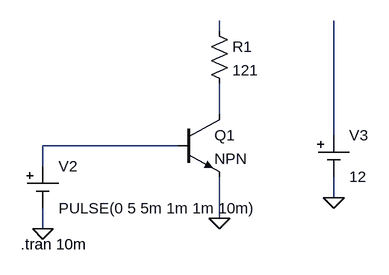
[diagram p0: schematic simulation1_only_R.asc]
simulation1_only_R.asc, the LTspice schematic file:
Version 4
SHEET 1 880 680
WIRE 192 -48 192 -64
WIRE 192 80 192 32
WIRE 368 112 368 -64
WIRE 128 128 -80 128
WIRE -80 160 -80 128
WIRE 368 208 368 176
WIRE 192 240 192 176
WIRE -80 256 -80 224
FLAG 192 240 0
FLAG -80 256 0
FLAG 368 208 0
SYMBOL npn 128 80 R0
SYMATTR InstName Q1
SYMBOL res 176 -64 R0
SYMATTR InstName R1
SYMATTR Value 121
SYMATTR SpiceLine tol=1 pwr=0.1
SYMBOL Misc\\cell -80 160 R0
WINDOW 123 0 0 Left 0
WINDOW 39 0 0 Left 0
SYMATTR InstName V2
SYMATTR Value PULSE(0 5 5m 1m 1m 10m)
SYMBOL Misc\\cell 368 112 R0
WINDOW 123 0 0 Left 0
WINDOW 39 0 0 Left 0
SYMATTR InstName V3
SYMATTR Value 12
TEXT -114 280 Left 2 !.tran 10m

The netlist it stands for:
* simulation1_only_R.asc
Q1 N002 N004 0 0 NPN
R1 N001 N002 121 tol=1 pwr=0.1
V2 N004 0 PULSE(0 5 5m 1m 1m 10m)
V3 N003 0 12
.model NPN NPN
.model PNP PNP
.lib standard.bjt
.tran 10m
.backanno
.end